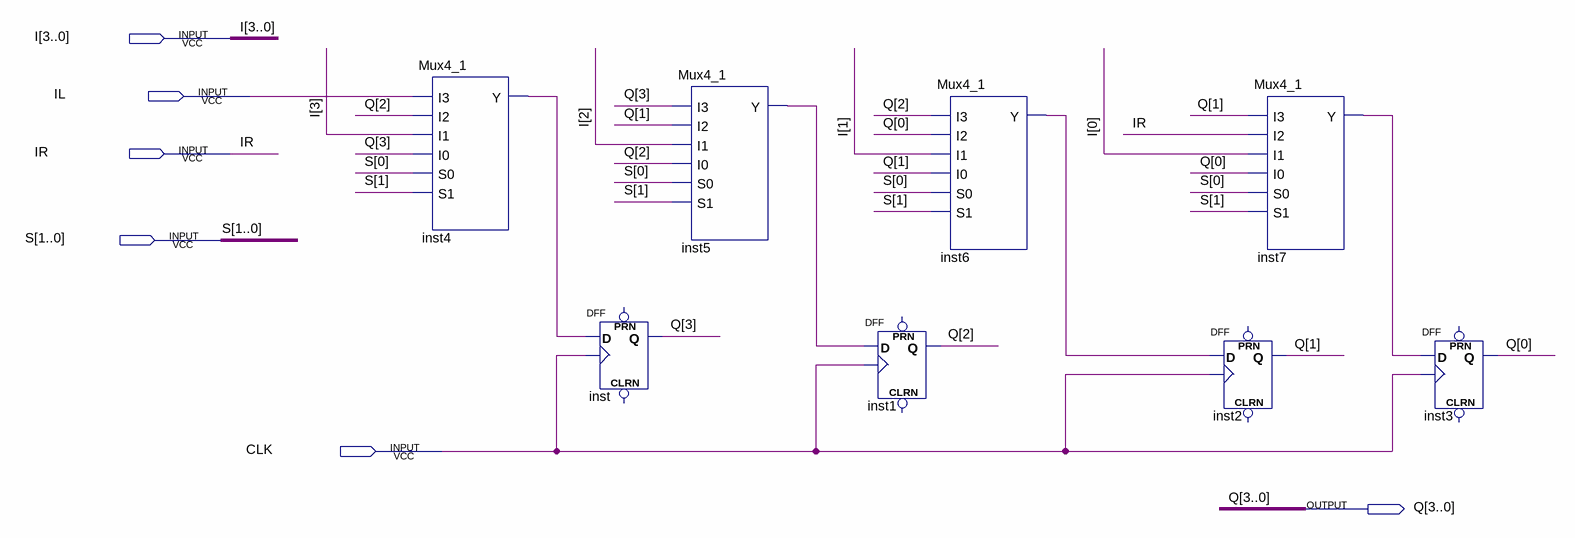
[diagram p0: schematic sheet]
// Quartus schematic SRwPL.bdf as structural Verilog: 8 symbols, 6 pins
module SRwPL (
  input  [3:0] I,
  input  IL,
  input  IR,
  input  [1:0] S,
  input  CLK,
  output [3:0] Q
);

  wire inst4_y, inst5_y, inst6_y, inst7_y;

  Mux4_1 inst4 (.I3(IL), .I2(Q[2]), .I1(I[3]), .I0(Q[3]), .S0(S[0]), .S1(S[1]), .Y(inst4_y));
  DFF inst (.CLK(CLK), .D(inst4_y), .Q(Q[3]));  // open: CLRN, PRN
  Mux4_1 inst5 (.I3(Q[3]), .I2(Q[1]), .I1(I[2]), .I0(Q[2]), .S0(S[0]), .S1(S[1]), .Y(inst5_y));
  DFF inst1 (.CLK(CLK), .D(inst5_y), .Q(Q[2]));  // open: CLRN, PRN
  Mux4_1 inst6 (.I3(Q[2]), .I2(Q[0]), .I1(I[1]), .I0(Q[1]), .S0(S[0]), .S1(S[1]), .Y(inst6_y));
  DFF inst2 (.CLK(CLK), .D(inst6_y), .Q(Q[1]));  // open: CLRN, PRN
  Mux4_1 inst7 (.I3(Q[1]), .I2(IR), .I1(I[0]), .I0(Q[0]), .S0(S[0]), .S1(S[1]), .Y(inst7_y));
  DFF inst3 (.CLK(CLK), .D(inst7_y), .Q(Q[0]));  // open: CLRN, PRN
endmodule
